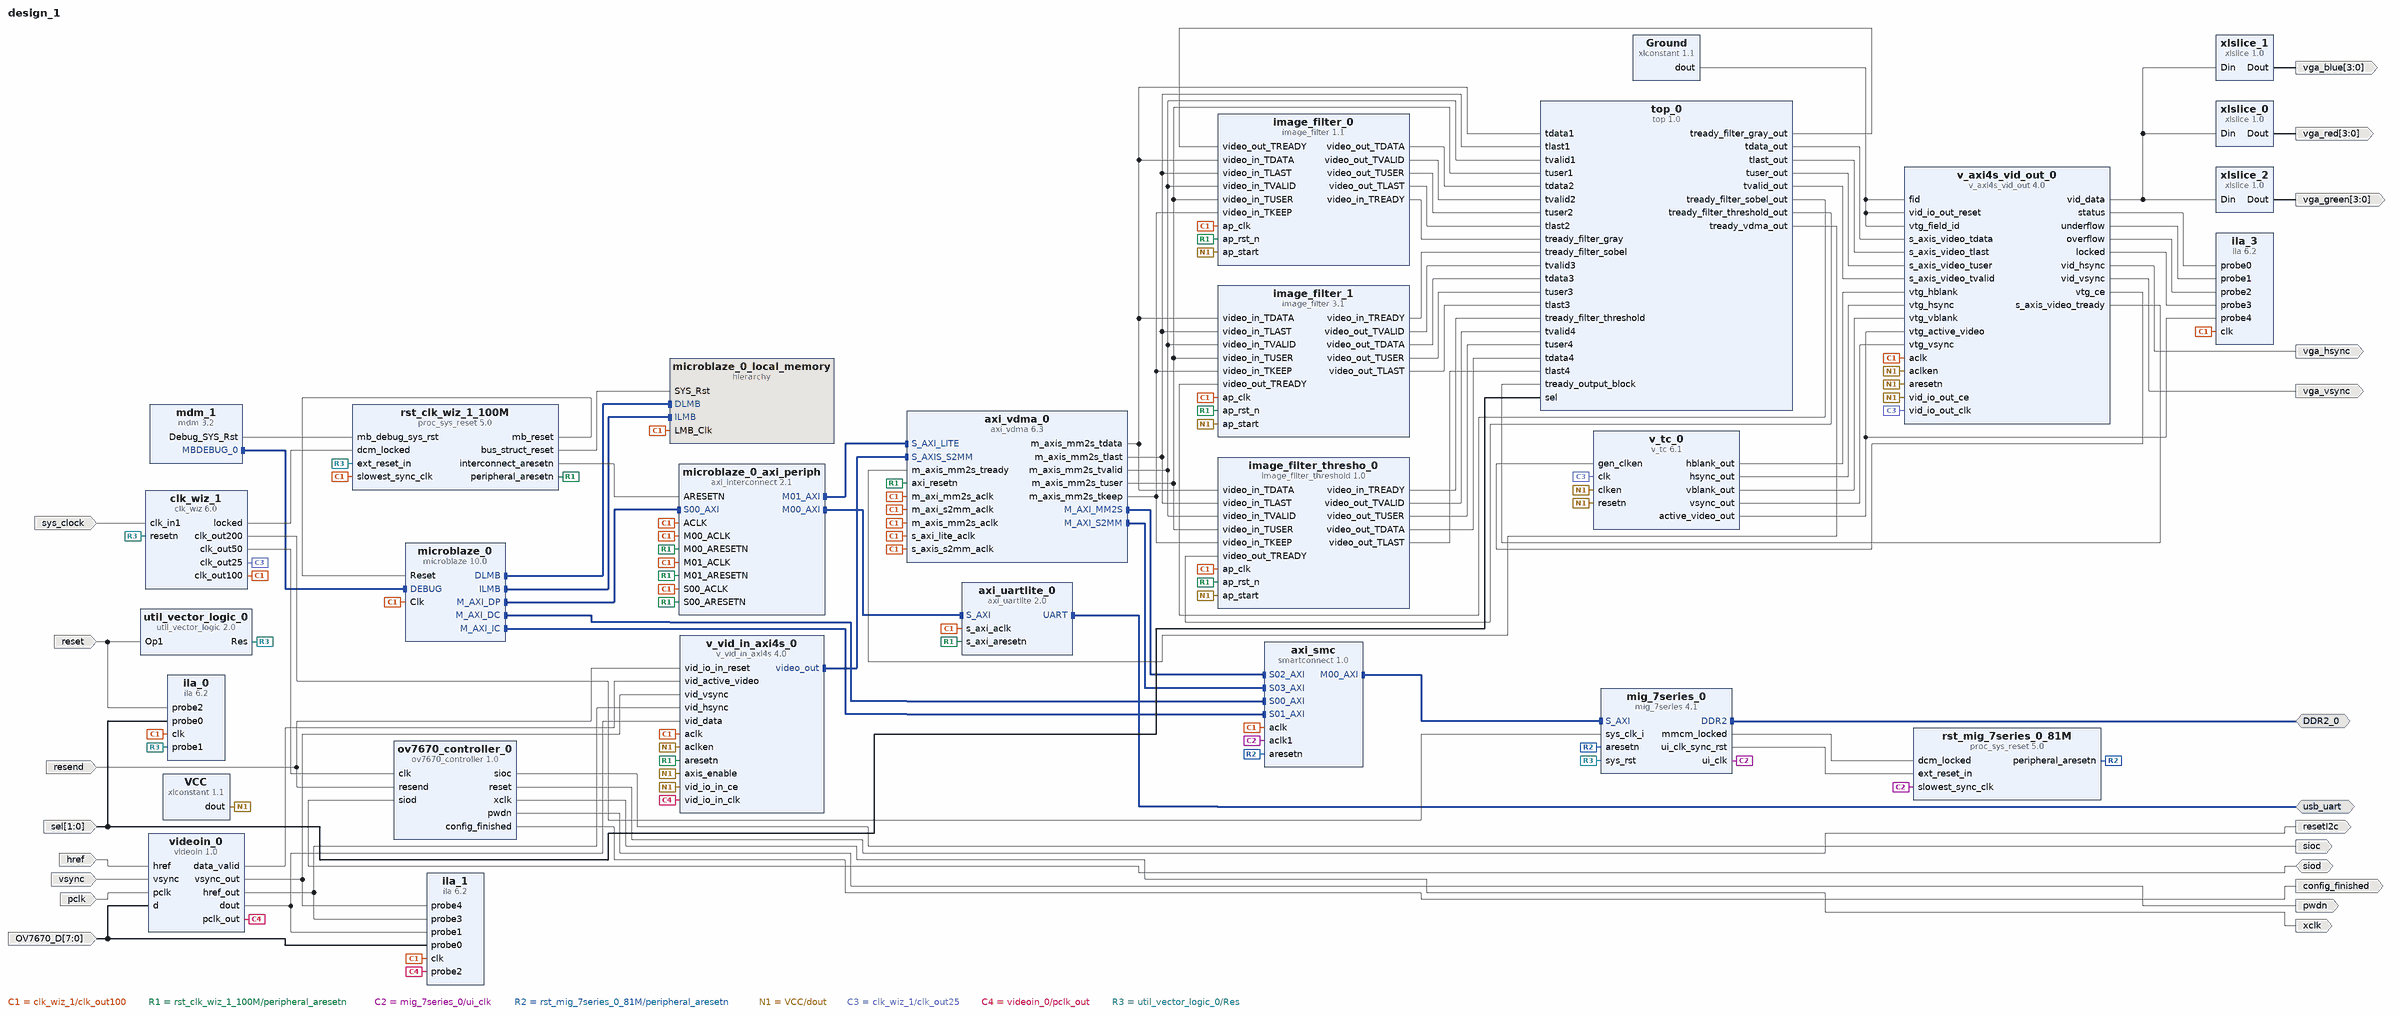
[diagram p0: block diagram of the top level]
# Vivado block design design_1, xc7a100tcsg324-1, Vivado 2018.1
create_bd_design design_1

create_bd_intf_port -mode Master -vlnv xilinx.com:interface:uart_rtl:1.0 usb_uart
create_bd_intf_port -mode Master -vlnv xilinx.com:interface:ddrx_rtl:1.0 DDR2_0
create_bd_port -dir I -type clk sys_clock
set_property -dict {CONFIG.FREQ_HZ 100000000 CONFIG.PHASE 0.000} [get_bd_ports sys_clock]
create_bd_port -dir I -from 7 -to 0 OV7670_D
create_bd_port -dir I resend
create_bd_port -dir O sioc
create_bd_port -dir O -type rst resetI2c
create_bd_port -dir IO siod
create_bd_port -dir O xclk
create_bd_port -dir O pwdn
create_bd_port -dir O config_finished
create_bd_port -dir O vga_vsync
create_bd_port -dir O vga_hsync
create_bd_port -dir O -from 3 -to 0 vga_green
create_bd_port -dir O -from 3 -to 0 vga_blue
create_bd_port -dir O -from 3 -to 0 vga_red
create_bd_port -dir I -type rst reset
set_property -dict {CONFIG.POLARITY ACTIVE_LOW} [get_bd_ports reset]
create_bd_port -dir I -from 1 -to 0 sel
create_bd_port -dir I href
create_bd_port -dir I vsync
create_bd_port -dir I pclk

create_bd_cell -type ip -vlnv xilinx.com:ip:microblaze:10.0 microblaze_0
set_property -dict [list \
  CONFIG.C_D_AXI 1 \
  CONFIG.C_D_LMB 1 \
  CONFIG.C_I_LMB 1 \
  CONFIG.C_DEBUG_ENABLED 1 \
  CONFIG.C_USE_ICACHE 1 \
  CONFIG.C_CACHE_BYTE_SIZE 16384 \
  CONFIG.C_USE_DCACHE 1 \
  CONFIG.C_DCACHE_BYTE_SIZE 16384 \
] [get_bd_cells microblaze_0]
create_bd_cell -type hier microblaze_0_local_memory
create_bd_cell -type ip -vlnv xilinx.com:ip:mdm:3.2 mdm_1
create_bd_cell -type ip -vlnv xilinx.com:ip:clk_wiz:6.0 clk_wiz_1
set_property -dict [list \
  CONFIG.CLKOUT2_USED true \
  CONFIG.CLKOUT3_USED true \
  CONFIG.CLKOUT4_USED true \
  CONFIG.NUM_OUT_CLKS 4 \
  CONFIG.CLK_OUT1_PORT clk_out100 \
  CONFIG.CLK_OUT2_PORT clk_out200 \
  CONFIG.CLK_OUT3_PORT clk_out50 \
  CONFIG.CLK_OUT4_PORT clk_out25 \
  CONFIG.CLKOUT2_REQUESTED_OUT_FREQ 200.000 \
  CONFIG.CLKOUT3_REQUESTED_OUT_FREQ 50.000 \
  CONFIG.CLKOUT4_REQUESTED_OUT_FREQ 25.000 \
  CONFIG.PRIM_SOURCE Single_ended_clock_capable_pin \
  CONFIG.RESET_PORT resetn \
  CONFIG.MMCM_DIVCLK_DIVIDE 1 \
  CONFIG.MMCM_CLKOUT1_DIVIDE 5 \
  CONFIG.MMCM_CLKOUT2_DIVIDE 20 \
  CONFIG.MMCM_CLKOUT3_DIVIDE 40 \
  CONFIG.RESET_TYPE ACTIVE_LOW \
  CONFIG.USE_BOARD_FLOW true \
  CONFIG.CLK_IN1_BOARD_INTERFACE sys_clock \
  CONFIG.RESET_BOARD_INTERFACE reset \
  CONFIG.CLKOUT2_JITTER 114.829 \
  CONFIG.CLKOUT2_PHASE_ERROR 98.575 \
  CONFIG.CLKOUT3_JITTER 151.636 \
  CONFIG.CLKOUT3_PHASE_ERROR 98.575 \
  CONFIG.CLKOUT4_JITTER 175.402 \
  CONFIG.CLKOUT4_PHASE_ERROR 98.575 \
] [get_bd_cells clk_wiz_1]
create_bd_cell -type ip -vlnv xilinx.com:ip:proc_sys_reset:5.0 rst_clk_wiz_1_100M
set_property -dict {CONFIG.USE_BOARD_FLOW true CONFIG.RESET_BOARD_INTERFACE reset} [get_bd_cells rst_clk_wiz_1_100M]
create_bd_cell -type ip -vlnv xilinx.com:ip:axi_uartlite:2.0 axi_uartlite_0
set_property -dict {CONFIG.USE_BOARD_FLOW true CONFIG.UARTLITE_BOARD_INTERFACE usb_uart} [get_bd_cells axi_uartlite_0]
create_bd_cell -type ip -vlnv xilinx.com:ip:axi_interconnect:2.1 microblaze_0_axi_periph
set_property -dict {CONFIG.NUM_MI 2} [get_bd_cells microblaze_0_axi_periph]
create_bd_cell -type ip -vlnv xilinx.com:ip:mig_7series:4.1 mig_7series_0
set_property -dict {CONFIG.RESET_BOARD_INTERFACE reset} [get_bd_cells mig_7series_0]
create_bd_cell -type ip -vlnv xilinx.com:ip:smartconnect:1.0 axi_smc
set_property -dict {CONFIG.NUM_SI 4 CONFIG.NUM_CLKS 2} [get_bd_cells axi_smc]
create_bd_cell -type ip -vlnv xilinx.com:ip:proc_sys_reset:5.0 rst_mig_7series_0_81M
create_bd_cell -type ip -vlnv xilinx.com:ip:xlconstant:1.1 VCC
create_bd_cell -type ip -vlnv xilinx.com:ip:xlconstant:1.1 Ground
set_property -dict {CONFIG.CONST_VAL 0} [get_bd_cells Ground]
create_bd_cell -type ip -vlnv xilinx.com:ip:v_vid_in_axi4s:4.0 v_vid_in_axi4s_0
set_property -dict {CONFIG.C_HAS_ASYNC_CLK 1} [get_bd_cells v_vid_in_axi4s_0]
create_bd_cell -type ip -vlnv xilinx.com:user:ov7670_controller:1.0 ov7670_controller_0
create_bd_cell -type ip -vlnv xilinx.com:ip:axi_vdma:6.3 axi_vdma_0
set_property -dict [list \
  CONFIG.c_m_axis_mm2s_tdata_width 24 \
  CONFIG.c_mm2s_linebuffer_depth 4096 \
  CONFIG.c_s2mm_linebuffer_depth 4096 \
  CONFIG.c_mm2s_max_burst_length 256 \
  CONFIG.c_s2mm_max_burst_length 256 \
] [get_bd_cells axi_vdma_0]
create_bd_cell -type ip -vlnv xilinx.com:ip:v_tc:6.1 v_tc_0
set_property -dict [list \
  CONFIG.HAS_AXI4_LITE false \
  CONFIG.HAS_INTC_IF true \
  CONFIG.VIDEO_MODE 640x480p \
  CONFIG.enable_detection false \
  CONFIG.enable_generation true \
] [get_bd_cells v_tc_0]
create_bd_cell -type ip -vlnv xilinx.com:ip:v_axi4s_vid_out:4.0 v_axi4s_vid_out_0
set_property -dict {CONFIG.C_HAS_ASYNC_CLK 1 CONFIG.C_ADDR_WIDTH 13 CONFIG.C_VTG_MASTER_SLAVE 0} [get_bd_cells v_axi4s_vid_out_0]
create_bd_cell -type ip -vlnv xilinx.com:ip:xlslice:1.0 xlslice_0
set_property -dict {CONFIG.DIN_TO 20 CONFIG.DIN_FROM 23 CONFIG.DIN_WIDTH 24 CONFIG.DOUT_WIDTH 4} [get_bd_cells xlslice_0]
create_bd_cell -type ip -vlnv xilinx.com:ip:xlslice:1.0 xlslice_1
set_property -dict {CONFIG.DIN_TO 4 CONFIG.DIN_FROM 7 CONFIG.DIN_WIDTH 24 CONFIG.DOUT_WIDTH 4} [get_bd_cells xlslice_1]
create_bd_cell -type ip -vlnv xilinx.com:ip:xlslice:1.0 xlslice_2
set_property -dict {CONFIG.DIN_TO 12 CONFIG.DIN_FROM 15 CONFIG.DIN_WIDTH 24 CONFIG.DOUT_WIDTH 4} [get_bd_cells xlslice_2]
create_bd_cell -type ip -vlnv xilinx.com:ip:ila:6.2 ila_0
set_property -dict [list \
  CONFIG.C_PROBE0_WIDTH 2 \
  CONFIG.C_NUM_OF_PROBES 3 \
  CONFIG.C_ENABLE_ILA_AXI_MON false \
  CONFIG.C_MONITOR_TYPE Native \
] [get_bd_cells ila_0]
create_bd_cell -type ip -vlnv xilinx.com:ip:util_vector_logic:2.0 util_vector_logic_0
set_property -dict {CONFIG.C_SIZE 1 CONFIG.C_OPERATION not} [get_bd_cells util_vector_logic_0]
create_bd_cell -type ip -vlnv xilinx.com:ip:ila:6.2 ila_1
set_property -dict [list \
  CONFIG.C_PROBE1_WIDTH 24 \
  CONFIG.C_PROBE0_WIDTH 8 \
  CONFIG.C_NUM_OF_PROBES 5 \
  CONFIG.C_ENABLE_ILA_AXI_MON false \
  CONFIG.C_MONITOR_TYPE Native \
] [get_bd_cells ila_1]
create_bd_cell -type ip -vlnv xilinx.com:user:videoin:1.0 videoin_0
create_bd_cell -type ip -vlnv xilinx.com:ip:ila:6.2 ila_3
set_property -dict [list \
  CONFIG.C_PROBE0_WIDTH 32 \
  CONFIG.C_NUM_OF_PROBES 6 \
  CONFIG.C_ENABLE_ILA_AXI_MON false \
  CONFIG.C_MONITOR_TYPE Native \
] [get_bd_cells ila_3]
create_bd_cell -type ip -vlnv ECE448:hls:image_filter:1.1 image_filter_0
create_bd_cell -type ip -vlnv xilinx.com:user:top:1.0 top_0
create_bd_cell -type ip -vlnv chris:hls:image_filter:3.1 image_filter_1
create_bd_cell -type ip -vlnv ECE448:hls:image_filter_threshold:1.0 image_filter_thresho_0

# ---- hierarchy /microblaze_0_local_memory ----
current_bd_instance /microblaze_0_local_memory
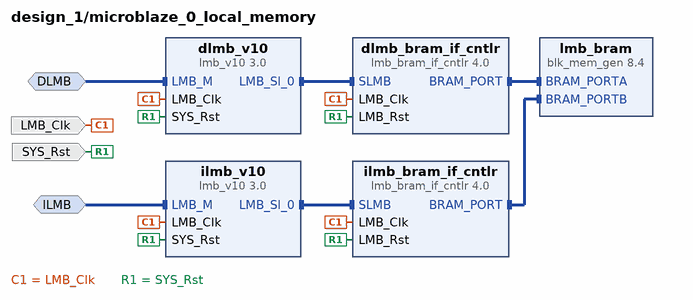
[diagram p1: block diagram inside /microblaze_0_local_memory]
create_bd_intf_pin -mode MirroredMaster -vlnv xilinx.com:interface:lmb_rtl:1.0 DLMB
create_bd_intf_pin -mode MirroredMaster -vlnv xilinx.com:interface:lmb_rtl:1.0 ILMB
create_bd_pin -dir I -type clk LMB_Clk
create_bd_pin -dir I -type rst SYS_Rst

create_bd_cell -type ip -vlnv xilinx.com:ip:lmb_v10:3.0 dlmb_v10
create_bd_cell -type ip -vlnv xilinx.com:ip:lmb_v10:3.0 ilmb_v10
create_bd_cell -type ip -vlnv xilinx.com:ip:lmb_bram_if_cntlr:4.0 dlmb_bram_if_cntlr
set_property -dict {CONFIG.C_ECC 0} [get_bd_cells dlmb_bram_if_cntlr]
create_bd_cell -type ip -vlnv xilinx.com:ip:lmb_bram_if_cntlr:4.0 ilmb_bram_if_cntlr
set_property -dict {CONFIG.C_ECC 0} [get_bd_cells ilmb_bram_if_cntlr]
create_bd_cell -type ip -vlnv xilinx.com:ip:blk_mem_gen:8.4 lmb_bram
set_property -dict {CONFIG.Memory_Type True_Dual_Port_RAM CONFIG.use_bram_block BRAM_Controller} [get_bd_cells lmb_bram]

# ---- connections ----

current_bd_instance /microblaze_0_local_memory
connect_bd_intf_net -intf_net microblaze_0_dlmb_bus [get_bd_intf_pins dlmb_v10/LMB_Sl_0] [get_bd_intf_pins dlmb_bram_if_cntlr/SLMB]
connect_bd_intf_net -intf_net microblaze_0_ilmb_bus [get_bd_intf_pins ilmb_v10/LMB_Sl_0] [get_bd_intf_pins ilmb_bram_if_cntlr/SLMB]
connect_bd_intf_net -intf_net microblaze_0_dlmb_cntlr [get_bd_intf_pins dlmb_bram_if_cntlr/BRAM_PORT] [get_bd_intf_pins lmb_bram/BRAM_PORTA]
connect_bd_intf_net -intf_net microblaze_0_ilmb_cntlr [get_bd_intf_pins ilmb_bram_if_cntlr/BRAM_PORT] [get_bd_intf_pins lmb_bram/BRAM_PORTB]
connect_bd_intf_net -intf_net microblaze_0_dlmb [get_bd_intf_pins DLMB] [get_bd_intf_pins dlmb_v10/LMB_M]
connect_bd_intf_net -intf_net microblaze_0_ilmb [get_bd_intf_pins ILMB] [get_bd_intf_pins ilmb_v10/LMB_M]
connect_bd_net -net microblaze_0_Clk [get_bd_pins LMB_Clk] \
  [get_bd_pins dlmb_v10/LMB_Clk] [get_bd_pins dlmb_bram_if_cntlr/LMB_Clk] [get_bd_pins ilmb_v10/LMB_Clk] \
  [get_bd_pins ilmb_bram_if_cntlr/LMB_Clk]
connect_bd_net [get_bd_pins SYS_Rst] \
  [get_bd_pins dlmb_v10/SYS_Rst] [get_bd_pins dlmb_bram_if_cntlr/LMB_Rst] [get_bd_pins ilmb_v10/SYS_Rst] \
  [get_bd_pins ilmb_bram_if_cntlr/LMB_Rst]

current_bd_instance /
connect_bd_intf_net [get_bd_intf_pins microblaze_0/DLMB] [get_bd_intf_pins microblaze_0_local_memory/DLMB]
connect_bd_intf_net [get_bd_intf_pins microblaze_0/ILMB] [get_bd_intf_pins microblaze_0_local_memory/ILMB]
connect_bd_intf_net [get_bd_intf_pins mdm_1/MBDEBUG_0] [get_bd_intf_pins microblaze_0/DEBUG]
connect_bd_intf_net [get_bd_intf_pins microblaze_0/M_AXI_DP] [get_bd_intf_pins microblaze_0_axi_periph/S00_AXI]
connect_bd_intf_net [get_bd_intf_pins microblaze_0_axi_periph/M00_AXI] [get_bd_intf_pins axi_uartlite_0/S_AXI]
connect_bd_intf_net [get_bd_intf_pins microblaze_0/M_AXI_DC] [get_bd_intf_pins axi_smc/S00_AXI]
connect_bd_intf_net [get_bd_intf_pins axi_smc/M00_AXI] [get_bd_intf_pins mig_7series_0/S_AXI]
connect_bd_intf_net [get_bd_intf_pins microblaze_0/M_AXI_IC] [get_bd_intf_pins axi_smc/S01_AXI]
connect_bd_intf_net [get_bd_intf_pins microblaze_0_axi_periph/M01_AXI] [get_bd_intf_pins axi_vdma_0/S_AXI_LITE]
connect_bd_intf_net [get_bd_intf_pins axi_vdma_0/M_AXI_MM2S] [get_bd_intf_pins axi_smc/S02_AXI]
connect_bd_intf_net [get_bd_intf_pins axi_vdma_0/M_AXI_S2MM] [get_bd_intf_pins axi_smc/S03_AXI]
connect_bd_intf_net [get_bd_intf_pins v_vid_in_axi4s_0/video_out] [get_bd_intf_pins axi_vdma_0/S_AXIS_S2MM]
connect_bd_intf_net [get_bd_intf_ports usb_uart] [get_bd_intf_pins axi_uartlite_0/UART]
connect_bd_intf_net [get_bd_intf_ports DDR2_0] [get_bd_intf_pins mig_7series_0/DDR2]
connect_bd_net -net microblaze_0_Clk [get_bd_pins clk_wiz_1/clk_out100] \
  [get_bd_pins microblaze_0/Clk] [get_bd_pins rst_clk_wiz_1_100M/slowest_sync_clk] [get_bd_pins axi_uartlite_0/s_axi_aclk] \
  [get_bd_pins axi_smc/aclk] [get_bd_pins v_vid_in_axi4s_0/aclk] [get_bd_pins axi_vdma_0/s_axi_lite_aclk] \
  [get_bd_pins axi_vdma_0/m_axi_mm2s_aclk] [get_bd_pins axi_vdma_0/m_axi_s2mm_aclk] [get_bd_pins axi_vdma_0/s_axis_s2mm_aclk] \
  [get_bd_pins axi_vdma_0/m_axis_mm2s_aclk] [get_bd_pins v_axi4s_vid_out_0/aclk] [get_bd_pins ila_0/clk] \
  [get_bd_pins ila_1/clk] [get_bd_pins ila_3/clk] [get_bd_pins microblaze_0_local_memory/LMB_Clk] \
  [get_bd_pins microblaze_0_axi_periph/S00_ACLK] [get_bd_pins microblaze_0_axi_periph/M00_ACLK] \
  [get_bd_pins microblaze_0_axi_periph/ACLK] [get_bd_pins microblaze_0_axi_periph/M01_ACLK] \
  [get_bd_pins image_filter_0/ap_clk] [get_bd_pins image_filter_1/ap_clk] [get_bd_pins image_filter_thresho_0/ap_clk]
connect_bd_net [get_bd_pins clk_wiz_1/locked] [get_bd_pins rst_clk_wiz_1_100M/dcm_locked]
connect_bd_net [get_bd_pins rst_clk_wiz_1_100M/mb_reset] [get_bd_pins microblaze_0/Reset]
connect_bd_net [get_bd_pins rst_clk_wiz_1_100M/bus_struct_reset] [get_bd_pins microblaze_0_local_memory/SYS_Rst]
connect_bd_net [get_bd_pins mdm_1/Debug_SYS_Rst] [get_bd_pins rst_clk_wiz_1_100M/mb_debug_sys_rst]
connect_bd_net [get_bd_ports sys_clock] [get_bd_pins clk_wiz_1/clk_in1]
connect_bd_net [get_bd_pins rst_clk_wiz_1_100M/peripheral_aresetn] \
  [get_bd_pins axi_uartlite_0/s_axi_aresetn] [get_bd_pins v_vid_in_axi4s_0/aresetn] [get_bd_pins axi_vdma_0/axi_resetn] \
  [get_bd_pins microblaze_0_axi_periph/S00_ARESETN] [get_bd_pins microblaze_0_axi_periph/M00_ARESETN] \
  [get_bd_pins microblaze_0_axi_periph/M01_ARESETN] [get_bd_pins image_filter_0/ap_rst_n] \
  [get_bd_pins image_filter_1/ap_rst_n] [get_bd_pins image_filter_thresho_0/ap_rst_n]
connect_bd_net [get_bd_pins rst_clk_wiz_1_100M/interconnect_aresetn] [get_bd_pins microblaze_0_axi_periph/ARESETN]
connect_bd_net [get_bd_pins mig_7series_0/ui_clk] [get_bd_pins axi_smc/aclk1] [get_bd_pins rst_mig_7series_0_81M/slowest_sync_clk]
connect_bd_net [get_bd_pins mig_7series_0/mmcm_locked] [get_bd_pins rst_mig_7series_0_81M/dcm_locked]
connect_bd_net [get_bd_pins mig_7series_0/ui_clk_sync_rst] [get_bd_pins rst_mig_7series_0_81M/ext_reset_in]
connect_bd_net [get_bd_pins rst_mig_7series_0_81M/peripheral_aresetn] [get_bd_pins mig_7series_0/aresetn] [get_bd_pins axi_smc/aresetn]
connect_bd_net [get_bd_pins clk_wiz_1/clk_out200] [get_bd_pins mig_7series_0/sys_clk_i]
connect_bd_net -net d_0_1 [get_bd_ports OV7670_D] [get_bd_pins ila_1/probe0] [get_bd_pins videoin_0/d]
connect_bd_net [get_bd_pins VCC/dout] \
  [get_bd_pins v_vid_in_axi4s_0/vid_io_in_ce] [get_bd_pins v_vid_in_axi4s_0/aclken] \
  [get_bd_pins v_vid_in_axi4s_0/axis_enable] [get_bd_pins v_tc_0/clken] [get_bd_pins v_tc_0/resetn] \
  [get_bd_pins v_axi4s_vid_out_0/vid_io_out_ce] [get_bd_pins v_axi4s_vid_out_0/aclken] \
  [get_bd_pins v_axi4s_vid_out_0/aresetn] [get_bd_pins image_filter_0/ap_start] [get_bd_pins image_filter_1/ap_start] \
  [get_bd_pins image_filter_thresho_0/ap_start]
connect_bd_net [get_bd_pins clk_wiz_1/clk_out50] [get_bd_pins ov7670_controller_0/clk]
connect_bd_net -net resend_0_1 [get_bd_ports resend] [get_bd_pins ov7670_controller_0/resend] [get_bd_pins v_vid_in_axi4s_0/vid_io_in_reset]
connect_bd_net [get_bd_pins ov7670_controller_0/sioc] [get_bd_ports sioc]
connect_bd_net [get_bd_pins ov7670_controller_0/reset] [get_bd_ports resetI2c]
connect_bd_net [get_bd_ports siod] [get_bd_pins ov7670_controller_0/siod]
connect_bd_net [get_bd_pins ov7670_controller_0/xclk] [get_bd_ports xclk]
connect_bd_net [get_bd_pins ov7670_controller_0/pwdn] [get_bd_ports pwdn]
connect_bd_net [get_bd_pins ov7670_controller_0/config_finished] [get_bd_ports config_finished]
connect_bd_net [get_bd_pins Ground/dout] \
  [get_bd_pins v_axi4s_vid_out_0/vid_io_out_reset] [get_bd_pins v_axi4s_vid_out_0/fid] \
  [get_bd_pins v_axi4s_vid_out_0/vtg_field_id]
connect_bd_net [get_bd_pins v_axi4s_vid_out_0/vid_vsync] [get_bd_ports vga_vsync]
connect_bd_net [get_bd_pins v_axi4s_vid_out_0/vid_hsync] [get_bd_ports vga_hsync]
connect_bd_net [get_bd_pins v_axi4s_vid_out_0/vid_data] [get_bd_pins xlslice_0/Din] [get_bd_pins xlslice_2/Din] [get_bd_pins xlslice_1/Din]
connect_bd_net [get_bd_pins xlslice_2/Dout] [get_bd_ports vga_green]
connect_bd_net [get_bd_pins xlslice_1/Dout] [get_bd_ports vga_blue]
connect_bd_net [get_bd_pins xlslice_0/Dout] [get_bd_ports vga_red]
connect_bd_net [get_bd_pins v_tc_0/active_video_out] [get_bd_pins v_axi4s_vid_out_0/vtg_active_video] [get_bd_pins ila_3/probe4]
connect_bd_net [get_bd_pins v_tc_0/hblank_out] [get_bd_pins v_axi4s_vid_out_0/vtg_hblank]
connect_bd_net [get_bd_pins v_tc_0/hsync_out] [get_bd_pins v_axi4s_vid_out_0/vtg_hsync]
connect_bd_net [get_bd_pins v_tc_0/vblank_out] [get_bd_pins v_axi4s_vid_out_0/vtg_vblank]
connect_bd_net [get_bd_pins v_tc_0/vsync_out] [get_bd_pins v_axi4s_vid_out_0/vtg_vsync]
connect_bd_net [get_bd_pins v_axi4s_vid_out_0/vtg_ce] [get_bd_pins v_tc_0/gen_clken]
connect_bd_net [get_bd_pins clk_wiz_1/clk_out25] [get_bd_pins v_tc_0/clk] [get_bd_pins v_axi4s_vid_out_0/vid_io_out_clk]
connect_bd_net [get_bd_pins videoin_0/vsync_out] [get_bd_pins v_vid_in_axi4s_0/vid_vsync] [get_bd_pins ila_1/probe4]
connect_bd_net [get_bd_pins videoin_0/pclk_out] [get_bd_pins v_vid_in_axi4s_0/vid_io_in_clk] [get_bd_pins ila_1/probe2]
connect_bd_net [get_bd_pins videoin_0/href_out] [get_bd_pins v_vid_in_axi4s_0/vid_hsync] [get_bd_pins ila_1/probe3]
connect_bd_net [get_bd_pins videoin_0/dout] [get_bd_pins v_vid_in_axi4s_0/vid_data] [get_bd_pins ila_1/probe1]
connect_bd_net [get_bd_ports reset] [get_bd_pins util_vector_logic_0/Op1] [get_bd_pins ila_0/probe2]
connect_bd_net -net reset_1 [get_bd_pins util_vector_logic_0/Res] \
  [get_bd_pins rst_clk_wiz_1_100M/ext_reset_in] [get_bd_pins mig_7series_0/sys_rst] [get_bd_pins clk_wiz_1/resetn] \
  [get_bd_pins ila_0/probe1]
connect_bd_net [get_bd_ports sel] [get_bd_pins ila_0/probe0] [get_bd_pins top_0/sel]
connect_bd_net [get_bd_ports href] [get_bd_pins videoin_0/href]
connect_bd_net [get_bd_ports vsync] [get_bd_pins videoin_0/vsync]
connect_bd_net [get_bd_ports pclk] [get_bd_pins videoin_0/pclk]
connect_bd_net [get_bd_pins videoin_0/data_valid] [get_bd_pins v_vid_in_axi4s_0/vid_active_video]
connect_bd_net [get_bd_pins v_axi4s_vid_out_0/status] [get_bd_pins ila_3/probe0]
connect_bd_net [get_bd_pins v_axi4s_vid_out_0/underflow] [get_bd_pins ila_3/probe1]
connect_bd_net [get_bd_pins v_axi4s_vid_out_0/overflow] [get_bd_pins ila_3/probe2]
connect_bd_net [get_bd_pins v_axi4s_vid_out_0/locked] [get_bd_pins ila_3/probe3]
connect_bd_net [get_bd_pins axi_vdma_0/m_axis_mm2s_tdata] \
  [get_bd_pins image_filter_0/video_in_TDATA] [get_bd_pins top_0/tdata1] [get_bd_pins image_filter_1/video_in_TDATA] \
  [get_bd_pins image_filter_thresho_0/video_in_TDATA]
connect_bd_net [get_bd_pins axi_vdma_0/m_axis_mm2s_tkeep] \
  [get_bd_pins image_filter_0/video_in_TKEEP] [get_bd_pins image_filter_1/video_in_TKEEP] \
  [get_bd_pins image_filter_thresho_0/video_in_TKEEP]
connect_bd_net [get_bd_pins axi_vdma_0/m_axis_mm2s_tlast] \
  [get_bd_pins image_filter_0/video_in_TLAST] [get_bd_pins top_0/tlast1] [get_bd_pins image_filter_1/video_in_TLAST] \
  [get_bd_pins image_filter_thresho_0/video_in_TLAST]
connect_bd_net [get_bd_pins axi_vdma_0/m_axis_mm2s_tvalid] \
  [get_bd_pins image_filter_0/video_in_TVALID] [get_bd_pins top_0/tvalid1] [get_bd_pins image_filter_1/video_in_TVALID] \
  [get_bd_pins image_filter_thresho_0/video_in_TVALID]
connect_bd_net [get_bd_pins axi_vdma_0/m_axis_mm2s_tuser] \
  [get_bd_pins image_filter_0/video_in_TUSER] [get_bd_pins top_0/tuser1] [get_bd_pins image_filter_1/video_in_TUSER] \
  [get_bd_pins image_filter_thresho_0/video_in_TUSER]
connect_bd_net [get_bd_pins image_filter_0/video_out_TDATA] [get_bd_pins top_0/tdata2]
connect_bd_net [get_bd_pins image_filter_0/video_out_TVALID] [get_bd_pins top_0/tvalid2]
connect_bd_net [get_bd_pins image_filter_0/video_out_TUSER] [get_bd_pins top_0/tuser2]
connect_bd_net [get_bd_pins image_filter_0/video_out_TLAST] [get_bd_pins top_0/tlast2]
connect_bd_net [get_bd_pins v_axi4s_vid_out_0/s_axis_video_tready] [get_bd_pins top_0/tready_output_block]
connect_bd_net [get_bd_pins image_filter_0/video_in_TREADY] [get_bd_pins top_0/tready_filter_gray]
connect_bd_net [get_bd_pins top_0/tready_vdma_out] [get_bd_pins axi_vdma_0/m_axis_mm2s_tready]
connect_bd_net [get_bd_pins top_0/tready_filter_gray_out] [get_bd_pins image_filter_0/video_out_TREADY]
connect_bd_net [get_bd_pins top_0/tdata_out] [get_bd_pins v_axi4s_vid_out_0/s_axis_video_tdata]
connect_bd_net [get_bd_pins top_0/tlast_out] [get_bd_pins v_axi4s_vid_out_0/s_axis_video_tlast]
connect_bd_net [get_bd_pins top_0/tuser_out] [get_bd_pins v_axi4s_vid_out_0/s_axis_video_tuser]
connect_bd_net [get_bd_pins top_0/tvalid_out] [get_bd_pins v_axi4s_vid_out_0/s_axis_video_tvalid]
connect_bd_net [get_bd_pins image_filter_1/video_in_TREADY] [get_bd_pins top_0/tready_filter_sobel]
connect_bd_net [get_bd_pins image_filter_1/video_out_TVALID] [get_bd_pins top_0/tvalid3]
connect_bd_net [get_bd_pins image_filter_1/video_out_TDATA] [get_bd_pins top_0/tdata3]
connect_bd_net [get_bd_pins image_filter_1/video_out_TUSER] [get_bd_pins top_0/tuser3]
connect_bd_net [get_bd_pins image_filter_1/video_out_TLAST] [get_bd_pins top_0/tlast3]
connect_bd_net [get_bd_pins top_0/tready_filter_sobel_out] [get_bd_pins image_filter_1/video_out_TREADY]
connect_bd_net [get_bd_pins image_filter_thresho_0/video_in_TREADY] [get_bd_pins top_0/tready_filter_threshold]
connect_bd_net [get_bd_pins top_0/tready_filter_threshold_out] [get_bd_pins image_filter_thresho_0/video_out_TREADY]
connect_bd_net [get_bd_pins image_filter_thresho_0/video_out_TVALID] [get_bd_pins top_0/tvalid4]
connect_bd_net [get_bd_pins image_filter_thresho_0/video_out_TUSER] [get_bd_pins top_0/tuser4]
connect_bd_net [get_bd_pins image_filter_thresho_0/video_out_TDATA] [get_bd_pins top_0/tdata4]
connect_bd_net [get_bd_pins image_filter_thresho_0/video_out_TLAST] [get_bd_pins top_0/tlast4]

# ---- address map ----
assign_bd_address -offset 0x80000000 -range 128M -target_address_space [get_bd_addr_spaces axi_vdma_0/Data_MM2S] [get_bd_addr_segs mig_7series_0/memmap/memaddr]
assign_bd_address -offset 0x80000000 -range 128M -target_address_space [get_bd_addr_spaces axi_vdma_0/Data_S2MM] [get_bd_addr_segs mig_7series_0/memmap/memaddr]
assign_bd_address -offset 0x00000000 -range 32K -target_address_space [get_bd_addr_spaces microblaze_0/Data] [get_bd_addr_segs microblaze_0_local_memory/dlmb_bram_if_cntlr/SLMB/Mem]
assign_bd_address -offset 0x40600000 -range 64K -target_address_space [get_bd_addr_spaces microblaze_0/Data] [get_bd_addr_segs axi_uartlite_0/S_AXI/Reg]
assign_bd_address -offset 0x44A00000 -range 64K -target_address_space [get_bd_addr_spaces microblaze_0/Data] [get_bd_addr_segs axi_vdma_0/S_AXI_LITE/Reg]
assign_bd_address -offset 0x80000000 -range 128M -target_address_space [get_bd_addr_spaces microblaze_0/Data] [get_bd_addr_segs mig_7series_0/memmap/memaddr]
assign_bd_address -offset 0x00000000 -range 32K -target_address_space [get_bd_addr_spaces microblaze_0/Instruction] [get_bd_addr_segs microblaze_0_local_memory/ilmb_bram_if_cntlr/SLMB/Mem]
assign_bd_address -offset 0x80000000 -range 128M -target_address_space [get_bd_addr_spaces microblaze_0/Instruction] [get_bd_addr_segs mig_7series_0/memmap/memaddr]

validate_bd_design
save_bd_design
